# EAGLE design ColourDEV (EAGLE 9.1.3)
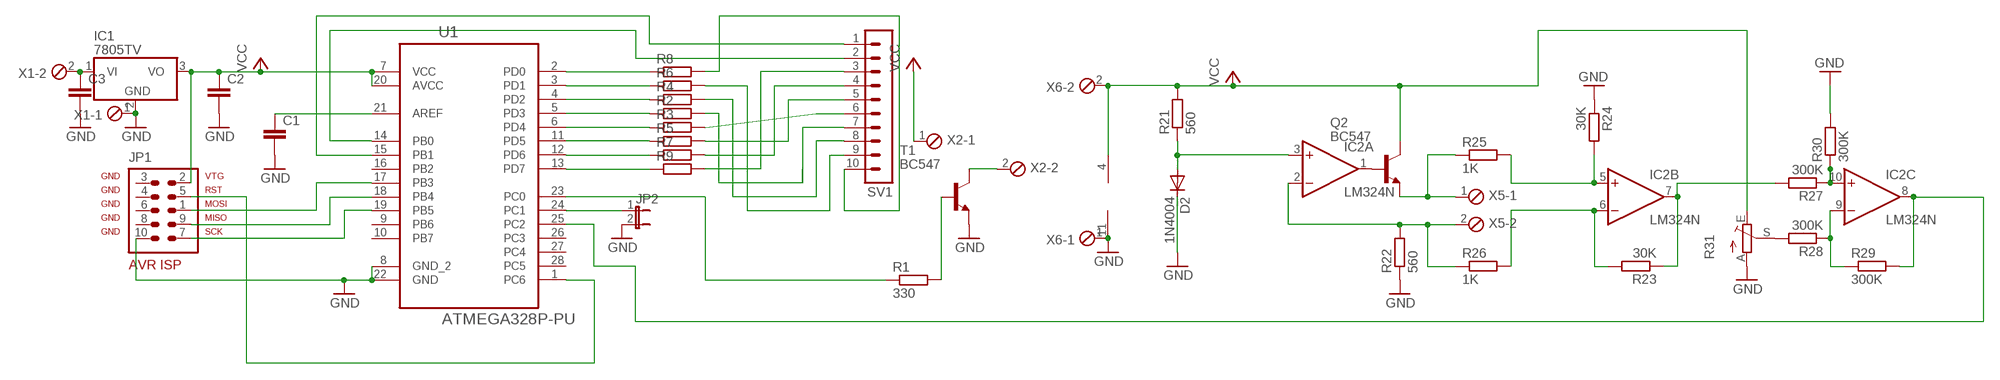
[diagram p0: schematic, sheet 1]

## Parts
C1  C-EU050-075X075  [C050-075X075]
C2  C-EU050-025X075  [C050-025X075]
C3  C-EU050-025X075  [C050-025X075]
D2  1N4004  [DO41-10]
IC1  7805TV  [TO220V]
IC2  LM324N  [DIL14]
JP1  AVR-ISP-10  [AVR-ISP-10]
JP2  JP1E  [JP1]
Q2  BC547  [TO92]
R1  330  R-EU_M1206  [M1206]
R2  R-EU_M1206  [M1206]
R3  R-EU_M1206  [M1206]
R4  R-EU_M1206  [M1206]
R5  R-EU_M1206  [M1206]
R6  R-EU_M1206  [M1206]
R7  R-EU_M1206  [M1206]
R8  R-EU_M1206  [M1206]
R9  R-EU_M1206  [M1206]
R21  560  R-EU_M1206  [M1206]
R22  560  R-EU_M1206  [M1206]
R23  30K  R-EU_M1206  [M1206]
R24  30K  R-EU_M1206  [M1206]
R25  1K  R-EU_M1206  [M1206]
R26  1K  R-EU_M1206  [M1206]
R27  300K  R-EU_M1206  [M1206]
R28  300K  R-EU_M1206  [M1206]
R29  300K  R-EU_M1206  [M1206]
R30  300K  R-EU_M1206  [M1206]
R31  TRIM_EU-LI10  [LI10]
SV1  MA10-1  [MA10-1]
T1  BC547  [TO92]
U1  ATMEGA328P-PU  [DIP254P762X457-28]
X1  MPT2  [2POL254]
X2  MPT2  [2POL254]
X5  MPT2  [2POL254]
X6  MPT2  [2POL254]

## Nets
GND: C1.2 C2.2 C3.2 D2.C IC1.2(GND) IC2.11(P:V-) JP1.10 JP2.2 R22.1 R24.1 R30.2 R31.A T1.1(E) U1.8(GND_2) U1.22(GND) X1.1 X6.1
N$1: R1.2 T1.2(B)
N$2: R1.1 U1.23(PC0)
N$3: JP1.5 U1.1(PC6)
N$4: JP1.1 U1.17(PB3)
N$5: JP1.9 U1.18(PB4)
N$6: JP1.7 U1.19(PB5)
N$7: R9.2 SV1.3
N$8: R7.2 SV1.4
N$9: R5.2 SV1.5
N$10: R3.2 SV1.6
N$11: R2.2 SV1.7
N$12: R4.2 SV1.8
N$13: R6.2 SV1.9
N$14: R8.2 SV1.10
N$15: SV1.2 U1.14(PB0)
N$16: SV1.1 U1.15(PB1)
N$17: C1.1 U1.21(AREF)
N$18: R5.1 U1.11(PD5)
N$19: R3.1 U1.6(PD4)
N$20: R2.1 U1.5(PD3)
N$21: R4.1 U1.4(PD2)
N$22: R6.1 U1.3(PD1)
N$23: R8.1 U1.2(PD0)
N$24: R7.1 U1.12(PD6)
N$25: R9.1 U1.13(PD7)
N$26: JP2.1 U1.24(PC1)
N$27: T1.3(C) X2.2
N$28: C3.1 IC1.1(VI) X1.2
N$39: D2.A IC2.3(A:+IN) R21.1
N$40: IC2.1(A:OUT) Q2.2(B)
N$41: Q2.1(E) R25.1 X5.1
N$42: IC2.2(A:-IN) R22.2 R26.1 X5.2
N$43: IC2.5(B:+IN) R24.2 R25.2
N$44: IC2.6(B:-IN) R23.2 R26.2
N$45: IC2.7(B:OUT) R23.1 R27.2
N$46: IC2.10(C:+IN) R27.1 R30.1
N$47: IC2.9(C:-IN) R28.1 R29.1
N$48: IC2.8(C:OUT) R29.2 U1.25(PC2)
N$49: R28.2 R31.S
VCC: C2.1 IC1.3(VO) IC2.4(P:V+) JP1.2 Q2.3(C) R21.2 R31.E U1.7(VCC) U1.20(AVCC) X2.1 X6.2
Unconnected: IC2.12(D:+IN) IC2.13(D:-IN) IC2.14(D:OUT) JP1.3 JP1.4 JP1.6 JP1.8 U1.9(PB6) U1.10(PB7) U1.16(PB2) U1.26(PC3) U1.27(PC4) U1.28(PC5)

## Library data of the parts
C1 = rcl:C-EU: CAPACITOR, European symbol; SPICEPREFIX: C
C2 C3 = resistor:C-EU: CAPACITOR, European symbol
D2 = diode:1N4004: DIODE general purpose rectifier, 1 A
IC1 = linear:78*: Positive VOLTAGE REGULATOR Source: http://cache.national.com/ds/LM/LM78L05.pdf http://www.fairchildsemi.com/ds/LM/LM7805.pdf
IC2 = linear:LM324: OP AMP
JP1 = avr-7:AVR-ISP-10: AVR ISP-10 Serial Programming Header
JP2 = jumper:JP1E: JUMPER
Q2 = transistor-npn:BC547*: NPN Transistor
R1-R9 = resistor:R-EU_: RESISTOR, European symbol
R21-R30 = rcl:R-EU_: RESISTOR, European symbol; SPICEPREFIX: R
R31 = pot:TRIM_EU-: POTENTIOMETER
SV1 = con-lstb:MA10-1: PIN HEADER; OC_FARNELL: unknown; OC_NEWARK: unknown
T1 = transistor:BC547: NPN TRANSISTOR
U1 = Atmel_By_element14_Batch_1-00:ATMEGA328P-PU: 8-bit Microcontroller with In-System Programmable Flash; MPN: ATMEGA328P-PU; OC_FARNELL: 1715487; OC_NEWARK: 15R0268; PACKAGE: PDIP-28; SUPPLIER: Atmel
X1 X2 X5 X6 = con-phoenix-254:MPT2: PHOENIX CONNECTOR; OC_FARNELL: unknown; OC_NEWARK: unknown

## Board
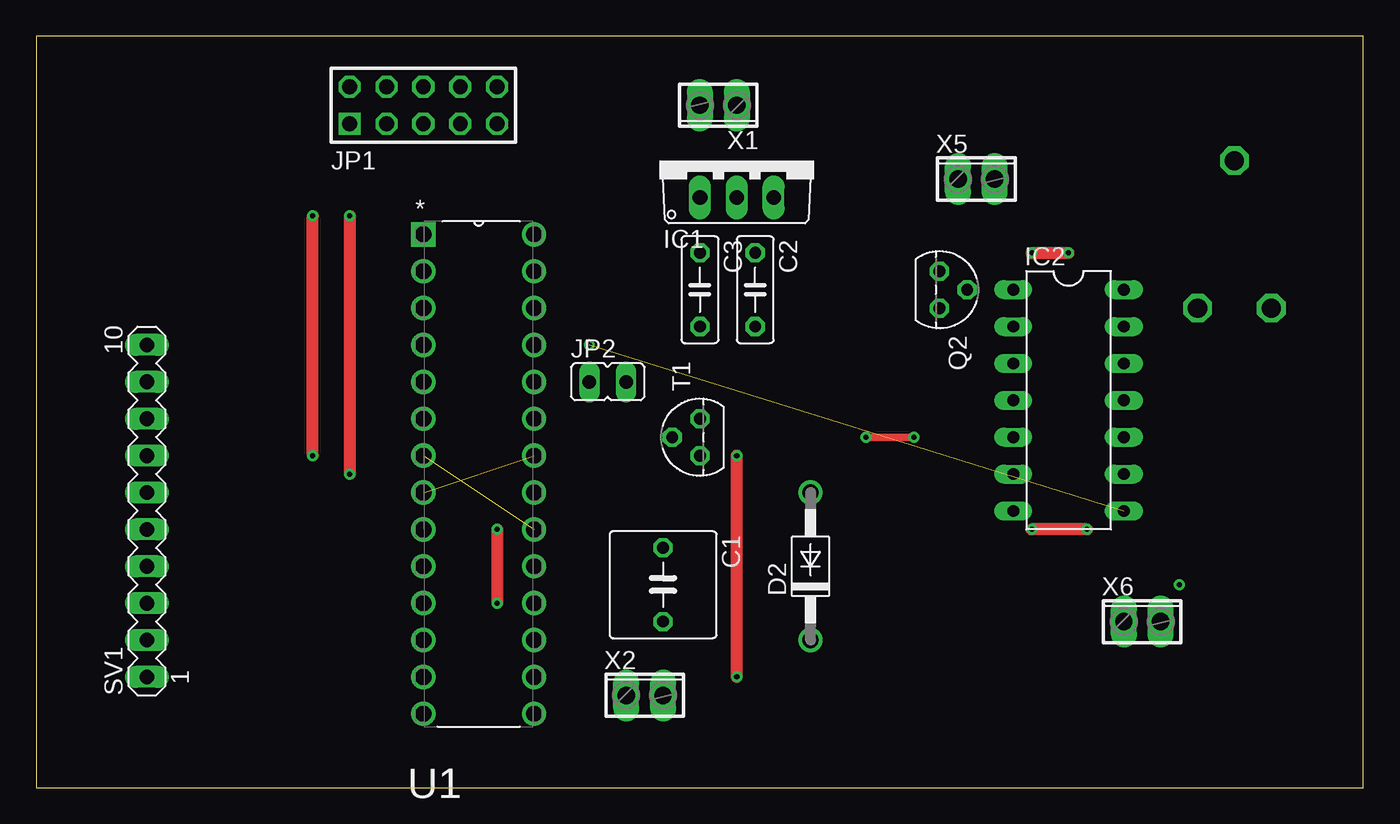
[diagram p1: board, top side]
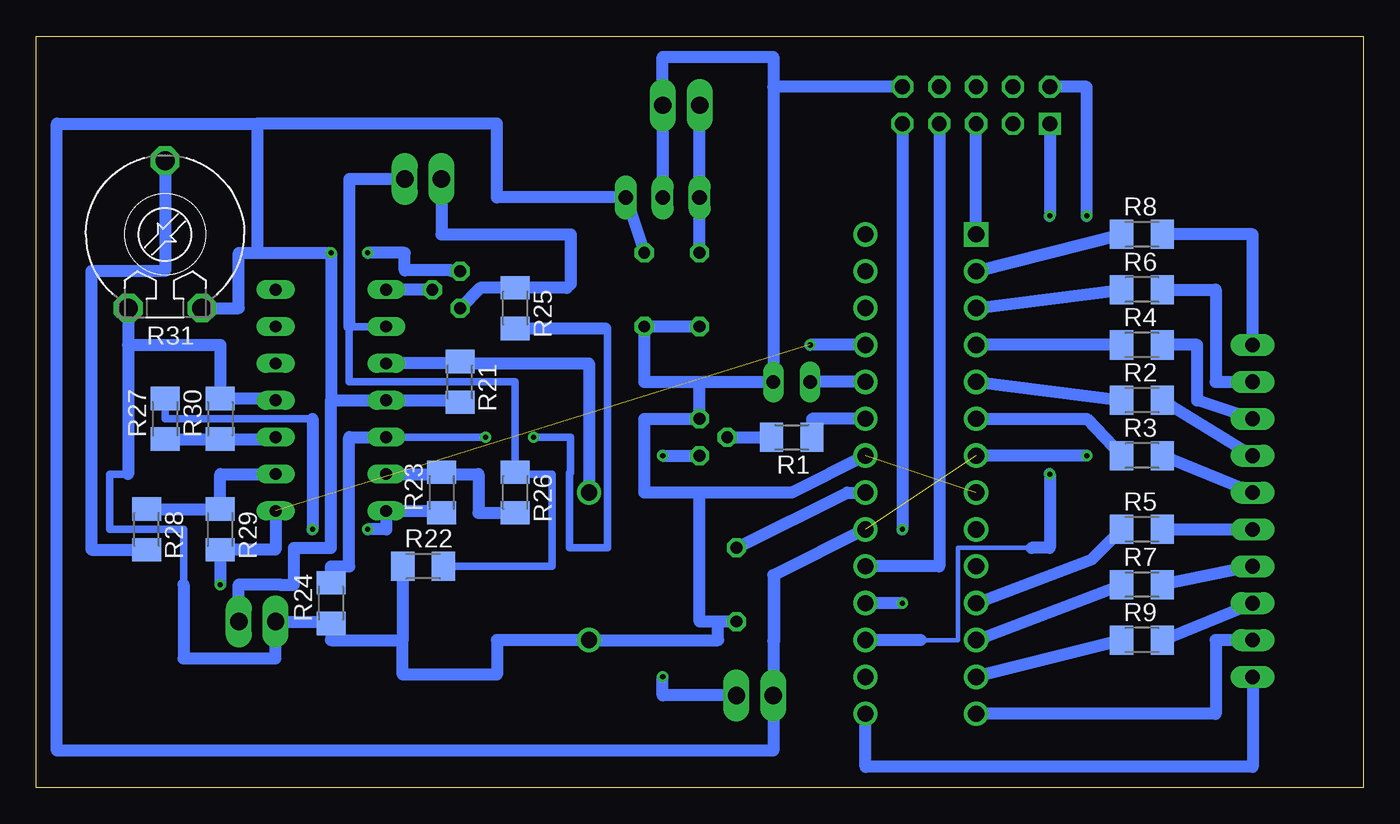
[diagram p2: board, bottom side, seen from below]

Size 91.42 x 51.74 mm. Coordinates in mm from the lower left corner, seen from the top.
Outline: 0,0 91.42,0 91.42,51.74 0,51.74 0,0
Copper layers (1*16): Top 0.035mm / dielectric 1.5mm / Bottom 0.035mm
Design rules "default": minimum track width 6mil, minimum drill 0.35mm, track to track 6mil, track to pad 6mil, pad to pad 6mil, via to via 6mil, smd to smd 6mil, copper to edge 40mil, drill to drill 6mil, minimum pad ring 10mil, minimum via ring 8mil, stop-mask expansion 4mil, vias tented up to drill 0mil, thermal gap 10mil

### Footprints (pad centres in the part's own frame; a part is rotated, then mirrored left to right if it is on the bottom)
C050-075X075 = drill 0.813 octagon: 1 -2.54,0; 2 2.54,0
C050-025X075 = drill 0.813 octagon: 1 -2.54,0; 2 2.54,0
DO41-10 = drill 1.118: A 5.08,0; C -5.08,0
TO220V = drill 1.016 long: 1 -2.54,-2.54; 2 0,-2.54; 3 2.54,-2.54
DIL14 = drill 0.813 long: 1 -7.62,-3.81; 2 -5.08,-3.81; 3 -2.54,-3.81; 4 0,-3.81; 5 2.54,-3.81; 6 5.08,-3.81; 7 7.62,-3.81; 8 7.62,3.81; 9 5.08,3.81; 10 2.54,3.81; 11 0,3.81; 12 -2.54,3.81; 13 -5.08,3.81; 14 -7.62,3.81
AVR-ISP-10 = drill 1.016 square: 1 -5.08,-1.27 | drill 1.016 octagon: 2 -5.08,1.27; 3 -2.54,-1.27; 4 -2.54,1.27; 5 0,-1.27; 6 0,1.27; 7 2.54,-1.27; 8 2.54,1.27; 9 5.08,-1.27; 10 5.08,1.27
JP1 = drill 0.914 long: 1 0,-1.27; 2 0,1.27
TO92 = drill 0.813 octagon: 1 1.27,0; 2 0,1.905; 3 -1.27,0
M1206 = smd 1.6 x 2: 1 -1.4,0; 2 1.4,0
LI10 = drill 1.321 octagon: A -2.54,-5.08; E 2.54,-5.08; S 0,5.08
MA10-1 = drill 1.016 long: 1 -11.43,0; 2 -8.89,0; 3 -6.35,0; 4 -3.81,0; 5 -1.27,0; 6 1.27,0; 7 3.81,0; 8 6.35,0; 9 8.89,0; 10 11.43,0
DIP254P762X457-28 = drill 1.118 square: 1 -7.62,33.02 | drill 1.118: 2 -7.62,30.48; 3 -7.62,27.94; 4 -7.62,25.4; 5 -7.62,22.86; 6 -7.62,20.32; 7 -7.62,17.78; 8 -7.62,15.24; 9 -7.62,12.7; 10 -7.62,10.16; 11 -7.62,7.62; 12 -7.62,5.08; 13 -7.62,2.54; 14 -7.62,0; 15 0,0; 16 0,2.54; 17 0,5.08; 18 0,7.62; 19 0,10.16; 20 0,12.7; 21 0,15.24; 22 0,17.78; 23 0,20.32; 24 0,22.86; 25 0,25.4; 26 0,27.94; 27 0,30.48; 28 0,33.02
2POL254 = drill 1.2 long: 1 -1.27,0; 2 1.27,0

### Placement (x,y rotation side)
C1  43.18,13.97 270 top
C2  49.53,34.29 270 top
C3  45.72,34.29 270 top
D2  53.34,15.24 90 top
IC1  48.26,43.18 0 top
IC2  71.12,26.67 270 top
JP1  26.67,46.99 0 top
JP2  39.37,27.94 270 top
Q2  62.23,34.29 270 top
R1  39.37,24.13 180 bottom
R2  15.24,26.67 0 bottom
R3  15.24,22.86 0 bottom
R4  15.24,30.48 0 bottom
R5  15.24,17.78 0 bottom
R6  15.24,34.29 0 bottom
R7  15.24,13.97 0 bottom
R8  15.24,38.1 0 bottom
R9  15.24,10.16 0 bottom
R21  62.23,27.94 270 bottom
R22  64.77,15.24 0 bottom
R23  63.5,20.32 90 bottom
R24  71.12,12.7 90 bottom
R25  58.42,33.02 270 bottom
R26  58.42,20.32 270 bottom
R27  82.55,25.4 90 bottom
R28  83.82,17.78 270 bottom
R29  78.74,17.78 270 bottom
R30  78.74,25.4 90 bottom
R31  82.55,38.1 0 bottom
SV1  7.62,19.05 90 top
T1  45.72,24.13 90 top
U1  34.29,5.08 0 top
X1  46.99,46.99 180 top
X2  41.91,6.35 0 top
X5  64.77,41.91 0 top
X6  76.2,11.43 0 top

### Tracks (layer width: path | path; a pad name or v marks a point on that pad's centre or on a via)
GND  (1 unrouted)
  Bottom 0.508: 85.09,21.59 86.36,21.59 86.36,17.78 81.28,17.78 81.28,13.97
  Bottom 0.813: 71.12,10.16 71.12,11.43 X6.1 74.93,8.89 81.28,8.89 81.28,13.97 | IC2.11 74.93,26.8 R30.2 78.74,30.48 85.09,30.48 | 71.12,10.16 66.17,10.16 | R31.A 85.09,30.48 | R22.1 66.17,11.43 66.17,10.16 | 66.17,10.16 66.17,7.77 59.69,7.77 59.69,10.16 D2.C 44.45,10.16 44.45,11.43 | R24.1 71.12,10.16 | 85.09,30.48 85.09,21.59 | JP1.10 40.64,48.26 | 40.64,48.26 JP2.2 45.72,27.94 | 45.72,27.94 T1.1 49.53,25.4 49.53,20.32 45.72,20.32 | 45.72,27.94 49.53,27.94 C2.2 C3.2 | U1.22 39.37,20.32 44.45,20.32 45.72,20.32 | 44.45,11.43 45.72,11.43 45.72,20.32 | C1.2 44.45,11.43 | IC1.2 X1.1 48.26,50.32 40.64,50.32 40.64,48.26
N$1
  Bottom 0.813: T1.2 R1.2
N$2
  Bottom 0.813: U1.23 37.97,25.4 R1.1
N$3
  Bottom 0.813: U1.1 JP1.5
N$4  (via drill 0.35)
  Top 0.813: v21.59,39.37 v21.59,21.59
  Bottom 0.305: 22.86,16.51 27.94,16.51 27.94,10.16 30.48,10.16
  Bottom 0.813: v21.59,21.59 21.59,16.51 22.86,16.51 | 30.48,10.16 U1.17 | JP1.1 v21.59,39.37
N$5  (via drill 0.35)
  Top 0.813: v31.75,17.78 v31.75,12.7
  Bottom 0.813: JP1.9 v31.75,17.78 | v31.75,12.7 U1.18
N$6
  Bottom 0.813: JP1.7 29.21,15.24 U1.19
N$7
  Bottom 0.813: R9.2 SV1.3
N$8
  Bottom 0.813: SV1.4 R7.2
N$9
  Bottom 0.813: R5.2 SV1.5
N$10
  Bottom 0.813: SV1.6 R3.2
N$11
  Bottom 0.813: R2.2 SV1.7
N$12
  Bottom 0.813: 13.97,30.48 R4.2 | R4.2 13.97,30.48 | R4.2 13.97,30.48 | SV1.8 11.43,26.67 11.43,30.48 R4.2
N$13
  Bottom 0.813: R6.2 10.16,34.29 10.16,27.94 SV1.9
N$14
  Bottom 0.813: SV1.10 7.62,38.1 R8.2
N$15
  Bottom 0.813: SV1.2 10.16,10.16 10.16,5.08 U1.14
N$16
  Bottom 0.813: SV1.1 7.62,1.42 34.29,1.42 U1.15
N$17
  Bottom 0.813: C1.1 35.56,20.32 U1.21
N$18
  Bottom 0.813: U1.11 18.69,15.73 R5.1
N$19
  Bottom 0.813: U1.6 19.05,25.4 R3.1
N$20
  Bottom 0.813: U1.5 R2.1
N$21
  Bottom 0.813: R4.1 U1.4
N$22
  Bottom 0.813: U1.3 R6.1
N$23
  Bottom 0.813: U1.2 R8.1
N$24
  Bottom 0.813: U1.12 R7.1
N$25
  Bottom 0.813: 16.51,10.16 R9.1 U1.13
N$26
  Bottom 0.813: U1.24 JP2.1
N$27  (via drill 0.35)
  Top 0.813: v48.26,7.62 v48.26,22.86
  Bottom 0.813: X2.2 48.26,6.35 v48.26,7.62 | v48.26,22.86 T1.3
N$28
  Bottom 0.813: C3.1 IC1.1 X1.2
N$39
  Bottom 0.813: R21.1 62.23,29.21 | 62.23,29.21 IC2.3 | 62.23,29.21 53.34,29.21 D2.A
N$40
  Bottom 0.813: Q2.2 IC2.1
N$41
  Bottom 0.813: X5.1 63.5,38.1 54.61,38.1 54.61,34.68 54.87,34.42 R25.1 60.83,34.42 Q2.1
N$42
  Bottom 0.508: IC2.2 69.85,31.75 69.85,27.94 58.42,27.94 R26.1 58.42,21.59 55.88,21.59 55.88,15.24 R22.2
  Bottom 0.813: X5.2 69.85,41.91 69.85,31.75
N$43  (via drill 0.35)
  Top 0.508: v60.48,24.13 v57.15,24.13
  Bottom 0.508: R25.2 52.07,31.62 52.07,16.51 54.69,16.51 54.69,21.67 54.61,21.67 54.61,24.13 v57.15,24.13 | IC2.5 v60.48,24.13
  Bottom 0.813: R24.2 71.12,15.24 69.85,15.24 69.85,24.13 IC2.5 | R25.2 52.22,31.62
N$44
  Bottom 0.813: IC2.6 63.5,21.59 | 63.5,21.59 R23.2 | 63.5,21.59 60.96,21.59 60.96,18.92 R26.2
N$45  (via drill 0.35)
  Top 0.813: v72.39,17.78 v68.58,17.78
  Bottom 0.508: R27.2 82.55,25.4 72.39,25.4
  Bottom 0.813: R23.1 63.5,19.05 IC2.7 67.31,17.78 v68.58,17.78 | 72.39,25.4 v72.39,17.78
N$46
  Bottom 0.813: IC2.10 74.93,24 R30.1 R27.1
N$47
  Bottom 0.813: R28.1 R29.1 78.74,21.59 IC2.9
N$48  (via drill 0.35)  (1 unrouted)
  Bottom 0.813: IC2.8 74.93,16.38 R29.2 78.74,13.99 | U1.25 v38.1,30.48
N$49
  Bottom 0.813: R31.S 82.55,35.56 87.63,35.56 87.63,16.38 R28.2
N$50  (via drill 0.35)
  other vias: 78.74,13.97
VCC  (via drill 0.35)  (1 unrouted)
  Top 0.813: v68.58,36.83 v71.12,36.83 | v19.05,22.86 v19.05,39.37
  Bottom 0.813: X6.2 77.47,13.99 74.64,13.99 74.64,13.97 73.66,13.97 73.66,16.51 71.12,16.51 71.12,26.67 | 71.12,26.67 IC2.4 62.23,26.67 R21.2 | R31.E 77.47,33.02 77.47,36.83 74.93,36.83 | 74.93,36.83 v71.12,36.83 71.12,26.67 | Q2.3 62.81,35.56 62.81,35.61 66.04,35.61 66.04,36.83 v68.58,36.83 | JP1.2 19.05,48.26 v19.05,39.37 | v19.05,22.86 U1.7 | X2.1 40.64,10.11 40.59,10.11 40.59,14.63 | U1.20 40.59,14.63 | 40.59,14.63 40.64,14.63 40.64,2.54 90,2.54 90,45.72 76.2,45.72 | 76.2,45.72 76.2,36.83 74.93,36.83 | C2.1 IC1.3 59.69,40.64 59.69,45.72 76.2,45.72